# Altium schematic sheet Power Factor Correction.SchDoc (part 2 of 2)
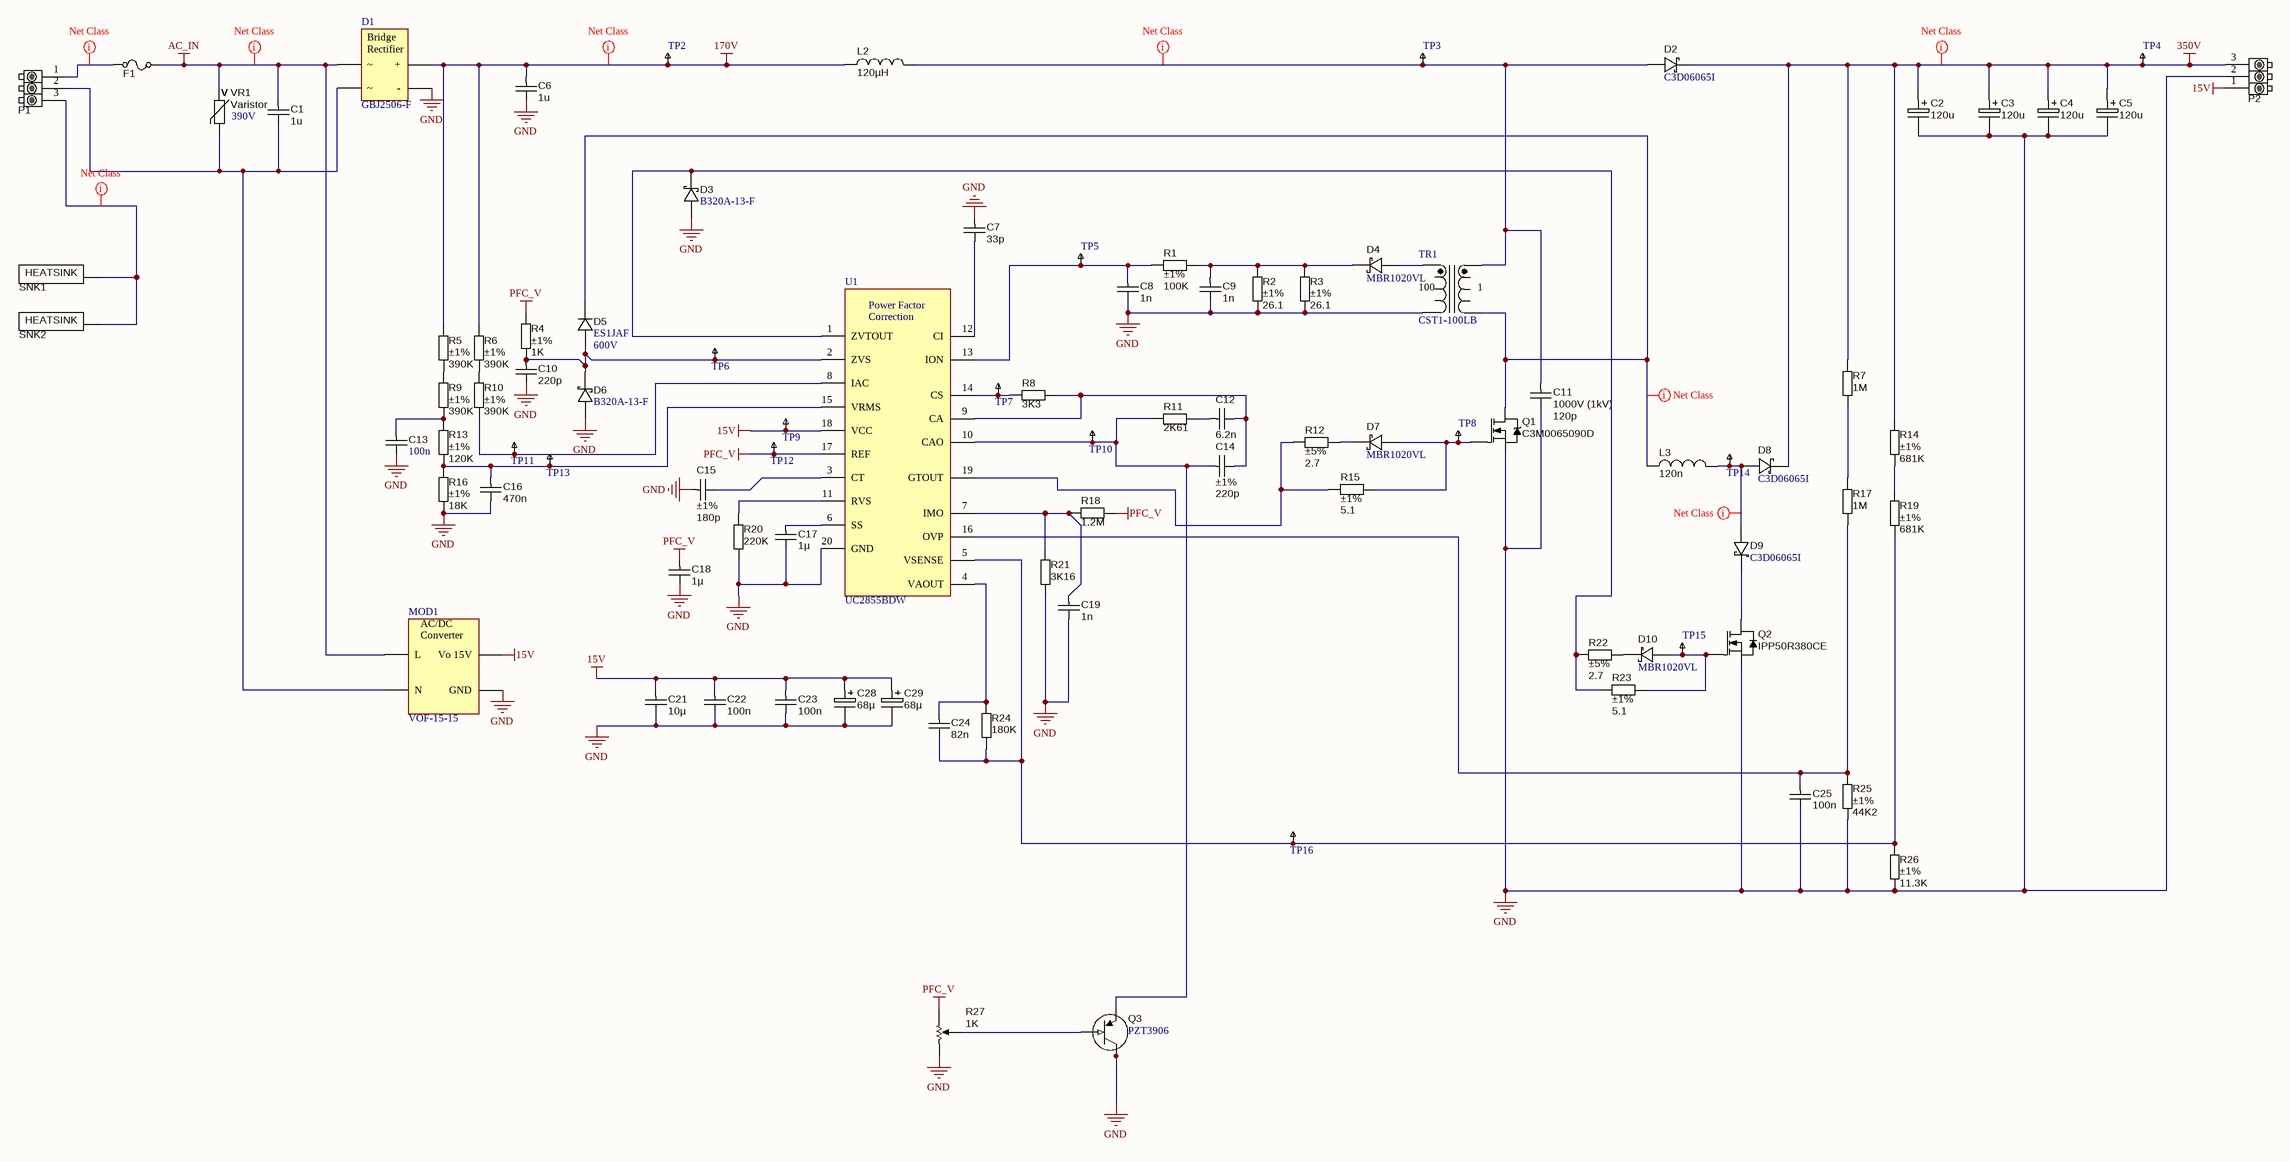
[diagram p1: Power Factor Correction.SchDoc]

## Notes on the sheet
- (in symbol AC_DC_265V_15V_VOF-15-15) AC/DC; Converter
- (in symbol BRIDGE_RECT_600V_25A_GBJ2506-F) Bridge; Rectifier
- (in symbol CURRENT_100:1_20A_CST1-100LB) 100; 1
- (in symbol HEATSINK_C247-025-1AE) HEATSINK
- (in symbol HEATSINK_OMNI-UNI-41-75) HEATSINK
- (in symbol PFC_UC2855BDW) Power Factor; Correction
- (in symbol Varistor_390V_4.5KA_B72214S0251K101) V

## Library data of the parts
C1 C6 = CAPMF_1u_420V_MK: 1µF Film Capacitor 220V 420V Polypropylene (PP), Metallized Radial; Manufacturer: KEMET; Tolerance: ±10%; Supplier 1: Digi-Key; Supplier Part Number 1: 399-13454-ND; RoHS: RoHS Compliant; Category: Capacitors; Stock 1: 1245; Pricing 1: 1=1.04, 10=0.793, 100=0.5673, 500=0.4392, 1000=0.3782, 2500=0.3538, 5000=0.3355 (USD); Packaging: Bulk; Part Status: Active; Voltage Rating - AC: 220V; Voltage Rating - DC: 420V; Dielectric Material: Polypropylene (PP), Metallized; Operating Temperature: -40°C ~ 110°C; Mounting Type: Through Hole; Package / Case: Radial; Size / Dimension: 0.709" L x 0.394" W (18.00mm x 10.00mm); Height - Seated (Max): 0.630" (16.00mm); Termination: PC Pins; Lead Spacing: 0.591" (15.00mm); Applications: High Frequency, Switching; High Pulse, DV/DT; Power Factor Correction (PFC); Features: -; ComponentLink1URL: https://search.kemet.com/component-edge/download/datasheet/R71MI4100AA30K.pdf; ComponentLink1Description: https://search.kemet.com/component-edge/download/datasheet/R71MI4100AA30K.pdf; Manufacturer Part Number: R71MI4100AA30K
C2-C5 = CAPE_120u_450V_THD: Aluminum Electrolytic Capacitors Radial, Can - Snap-In 2000 Hrs @ 85°C; Manufacturer: United Chemi-Con; Manufacturer Part Number: ESMR451VSN121MP25S; Tolerance: ±20%; Polarization: Polar; Ripple Current - Low Frequency: 1.12A @ 120Hz; Ripple Current - High Frequency: 1.6016A @ 50kHz; Supplier 1: Digi-Key; Supplier Part Number 1: 565-4506-ND; RoHS: RoHS Compliant; Category: Capacitors; Stock 1: 399; Pricing 1: 1=3.84, 10=3.098, 100=2.4161, 500=1.79656, 1000=1.67265, 2500=1.6107, 5000=1.6048 (USD); Packaging: Bulk; Part Status: Active; ESR (Equivalent Series Resistance): -; Lifetime @ Temp.: 2000 Hrs @ 85°C; Operating Temperature: -25°C ~ 85°C; Applications: General Purpose; Lead Spacing: 0.394" (10.00mm); Size / Dimension: 0.866" Dia (22.00mm); Height - Seated (Max): 1.083" (27.50mm); Surface Mount Land Size: -; Mounting Type: Through Hole; Package / Case: Radial, Can - Snap-In; ComponentLink1URL: http://www.chemi-con.co.jp/cgi-bin/CAT_DB/SEARCH/cat_db_al.cgi?e=e&j=p&pdfname=smrlug; ComponentLink1Description: http://www.chemi-con.co.jp/cgi-bin/CAT_DB/SEARCH/cat_db_al.cgi?e=e&j=p&pdfname=smrlug; Value: 120u
C7 = CAPC_33p_0603_NP0_50V_5%: Capacitor SMD Cer 33pF 5% 50V NP0 0603; Manufacturer: Murata Electronics North America; Manufacturer Part Number: GRM1885C1H330JA01D; Temperature Coefficient: C0G, NP0; Tolerance: ±5%; Supplier 1: Digi-Key; Supplier Part Number 1: 490-1415-1-ND; RoHS: RoHS Compliant; Category: Capacitors; Stock 1: 609419; Pricing 1: 1=0.1, 10=0.071, 100=0.0316, 500=0.0226, 1000=0.01776 (USD); Packaging: Cut Tape (CT); Part Status: Active; Voltage - Rated: 50V; Operating Temperature: -55°C ~ 125°C; Features: -; Ratings: -; Applications: General Purpose; Mounting Type: Surface Mount, MLCC; Package / Case: 0603 (1608 Metric); Size / Dimension: 0.063" L x 0.031" W (1.60mm x 0.80mm); Height - Seated (Max): -; Thickness (Max): 0.035" (0.90mm); Lead Spacing: -; Lead Style: -; ComponentLink1URL: http://www.murata.com/~/media/webrenewal/support/library/catalog/products/capacitor/mlcc/c02e.pdf; ComponentLink1Description: http://www.murata.com/~/media/webrenewal/support/library/catalog/products/capacitor/mlcc/c02e.pdf; Value: 33p
C8 C9 C19 = CAPC_1n_0603_X7R_100V_10%: Capacitor SMD Cer 1nF 10% 100V X7R 0603; Manufacturer 1: Murata Electronics North America; Manufacturer Part Number 1: GCM188R72A102KA37D; Ratings: 100V; X7R; Material: ceramic; SCDType: spec; Package / Case: 0603 (1608 metric); Tolerance: ±10%; Supplier 1: Digi-Key; Supplier Part Number 1: 490-4780-1-ND; Operating Temperature: -55°C ~ 125°C; Size / Dimension: 0.063" L x 0.031" W (1.60mm x 0.80mm); Thickness (Max): 0.035" (0.90mm); ComponentLink1URL: http://search.murata.co.jp/Ceramy/image/img/PDF/ENG/GCM188R72A102KA37.pdf; ComponentLink1Description: http://search.murata.co.jp/Ceramy/image/img/PDF/ENG/GCM188R72A102KA37.pdf
C10 = CAPC_220p_0603_NP0_50V_5%: Capacitor SMD Cer 220pF 5% 50V NP0 0603; Manufacturer 1: Murata Electronics North America; Manufacturer Part Number 1: GRM1885C1H221JA01D; Ratings: 50V; NP0; Material: Ceramic NP0; SCDType: spec; Tolerance: ±5%; Package / Case: 0603 (1608 metric); Supplier 1: Digi-Key; Supplier Part Number 1: 490-1435-1-ND; Value: 220p
C11 = CAPC_120p_1206_U2J_1KV_5%: Capacitor SMD Cer 120pF 5% U2J 1KV 1206; Manufacturer: Murata Electronics North America; Manufacturer Part Number: GRM31A7U3A121JW31D; Tolerance: ±5%; Supplier 1: Digi-Key; Supplier Part Number 1: 490-8331-1-ND; RoHS: RoHS Compliant; Category: Capacitors; Stock 1: 3961; Pricing 1: 1=0.48, 10=0.336, 100=0.2015, 500=0.15114, 1000=0.12764 (USD); Packaging: Cut Tape (CT); Part Status: Active; Temperature Coefficient: U2J; Operating Temperature: -55°C ~ 125°C; Features: -; Ratings: -; Applications: General Purpose; Mounting Type: Surface Mount, MLCC; Package / Case: 1206 (3216 Metric); Size / Dimension: 0.126" L x 0.063" W (3.20mm x 1.60mm); Height - Seated (Max): -; Thickness (Max): 0.039" (1.00mm); Lead Spacing: -; Lead Style: -; ComponentLink1URL: http://search.murata.co.jp/Ceramy/image/img/A01X/G101/ENG/GRM31A7U3A121JW31-01.pdf; ComponentLink1Description: http://search.murata.co.jp/Ceramy/image/img/A01X/G101/ENG/GRM31A7U3A121JW31-01.pdf; Value: 120p
C12 = CAPC_6.2nF_0603_NP0_50V: Capacitor SMD Cer 8pF ±0.5pF 50V NP0 0603; Manufacturer: Murata Electronics North America; Manufacturer Part Number: GRM2195C1H622JA01D; Tolerance: ±5%; Temperature Coefficient: C0G, NP0; Supplier 1: Digi-Key; Supplier Part Number 1: 490-1637-1-ND; RoHS: RoHS Compliant; Category: Capacitors; Stock 1: 29114; Pricing 1: 1=0.35, 10=0.241, 100=0.1364, 500=0.09626, 1000=0.08422 (USD); Packaging: Cut Tape (CT); Part Status: Active; Voltage - Rated: 50V; Operating Temperature: -55°C ~ 125°C; Features: -; Ratings: -; Applications: General Purpose; Mounting Type: Surface Mount, MLCC; Package / Case: 0805 (2012 Metric); Size / Dimension: 0.079" L x 0.049" W (2.00mm x 1.25mm); Height - Seated (Max): -; Thickness (Max): 0.037" (0.95mm); Lead Spacing: -; Lead Style: -; ComponentLink1URL: http://www.murata.com/~/media/webrenewal/support/library/catalog/products/capacitor/mlcc/c02e.ashx?la=en-us; ComponentLink1Description: http://www.murata.com/~/media/webrenewal/support/library/catalog/products/capacitor/mlcc/c02e.ashx?la=en-us; Value: 6.2n
C13 = CAPC_100n_1812_X7R_630V_10%: 0.1µF ±10% 630V Ceramic Capacitor X7R 1812 (4532 Metric); Manufacturer: Murata Electronics North America; Supplier 1: Digi-Key; Supplier Part Number 1: 490-3518-1-ND; RoHS: RoHS Compliant; Category: Capacitors; Stock 1: 64655; Pricing 1: 1=0.72, 10=0.531, 100=0.364, 500=0.2882 (USD); Packaging: Cut Tape (CT); Part Status: Active; Tolerance: ±10%; Voltage - Rated: 630V; Temperature Coefficient: X7R; Operating Temperature: -55°C ~ 125°C; Features: -; Ratings: -; Applications: General Purpose; Mounting Type: Surface Mount, MLCC; Package / Case: 1812 (4532 Metric); Size / Dimension: 0.177" L x 0.126" W (4.50mm x 3.20mm); Height - Seated (Max): -; Thickness (Max): 0.087" (2.20mm); Lead Spacing: -; Lead Style: -; ComponentLink1URL: http://search.murata.co.jp/Ceramy/image/img/A01X/G101/ENG/GRM43DR72J104KW01-01.pdf; ComponentLink1Description: http://search.murata.co.jp/Ceramy/image/img/A01X/G101/ENG/GRM43DR72J104KW01-01.pdf; Manufacturer Part Number: GRM43DR72J104KW01L
C14 = CAPC_220p_0603_NP0_50V_1%: Capacitor SMD Cer 220pF 1% 50V NP0 0603; Manufacturer 1: AVX Corporation; Manufacturer Part Number 1: 06035A221FAT2A; Ratings: 50V; NP0; SCDType: spec; Operating Temperature: -55°C ~ 125°C; Package / Case: 0603 (1608 Metric); Size / Dimension: 0.063" L x 0.031" W (1.60mm x 0.80mm); Thickness (Max): 0.037" (0.95mm); Manufacturer 2: TDK Corporation; Manufacturer Part Number 2: C1608C0G1H221F080AA; Supplier 1: Digi-Key; Supplier Part Number 1: 478-3719-1-ND; ComponentLink1URL: http://www.avx.com/docs/Catalogs/ccog.pdf; ComponentLink1Description: http://www.avx.com/docs/Catalogs/ccog.pdf; Supplier 2: Digi-Key; Supplier Part Number 2: 445-5369-1-ND; ComponentLink2URL: http://www.tdk.com/pdf/tight_tol_B11.pdf; ComponentLink2Description: http://www.tdk.com/pdf/tight_tol_B11.pdf; Supplier 3: Digi-Key; Supplier Part Number 3: 399-7876-1-ND; Manufacturer 3: Kemet; Manufacturer Part Number 3: C0603C221F5GACTU; ComponentLink3URL: http://www.kemet.com/datasheets&C0603C221F5GACTU; ComponentLink3Description: http://www.kemet.com/datasheets&C0603C221F5GACTU; Value: 220p
C15 = CAPC_180p_0603_NP0_50V_1%: Capacitor SMD Cer 180pF 1% 50V NP0 0603; Manufacturer 1: AVX Corporation; Manufacturer Part Number 1: 06035A181FAT2A; Ratings: 50V; NP0; SCDType: source; Operating Temperature: -55°C ~ 125°C; Package / Case: 0603 (1608 Metric); Size / Dimension: 0.063" L x 0.031" W (1.60mm x 0.80mm); Supplier 1: Digi-Key; Supplier Part Number 1: 478-6029-1-ND; ComponentLink1URL: http://www.avx.com/docs/Catalogs/ccog.pdf; ComponentLink1Description: http://www.avx.com/docs/Catalogs/ccog.pdf; Supplier 2: Digi-Key; Supplier Part Number 2: 1276-2211-1-ND; Manufacturer 2: Samsung Electro-Mechanics America, Inc; Manufacturer Part Number 2: CL10C181FB8NNNC; RoHS 2: RoHS Compliant; ComponentLink2URL: http://www.samsungsem.com/servlet/FileDownload?type=spec&file=CL10C181FB8NNNC.pdf; ComponentLink2Description: http://www.samsungsem.com/servlet/FileDownload?type=spec&file=CL10C181FB8NNNC.pdf; Supplier 3: Digi-Key; Supplier Part Number 3: C0603C181F5GACTU-ND; Manufacturer 3: Kemet; Manufacturer Part Number 3: C0603C181F5GACTU; RoHS 3: RoHS Compliant; ComponentLink3URL: http://www.kemet.com/datasheets&C0603C181F5GACTU; ComponentLink3Description: http://www.kemet.com/datasheets&C0603C181F5GACTU; Value: 180p
C16 = CAPC_470n_0805_X7R_50V_10%: 0.47µF ±10% 50V Ceramic Capacitor X7R 0805 (2012 Metric); Manufacturer: Murata Electronics North America; Manufacturer Part Number: GRM21BR71H474KA88K; Supplier 1: Digi-Key; Supplier Part Number 1: 490-8319-1-ND; RoHS: RoHS Compliant; Category: Capacitors; Stock 1: 76560; Pricing 1: 1=0.35, 10=0.244, 100=0.1465, 500=0.10986, 1000=0.09278, 2500=0.08789, 5000=0.08301 (USD); Packaging: Cut Tape (CT); Part Status: Active; Tolerance: ±10%; Voltage - Rated: 50V; Temperature Coefficient: X7R; Operating Temperature: -55°C ~ 125°C; Features: -; Ratings: -; Applications: General Purpose; Mounting Type: Surface Mount, MLCC; Package / Case: 0805 (2012 Metric); Size / Dimension: 0.079" L x 0.049" W (2.00mm x 1.25mm); Height - Seated (Max): -; Thickness (Max): 0.053" (1.35mm); Lead Spacing: -; Lead Style: -; ComponentLink1URL: http://search.murata.co.jp/Ceramy/image/img/A01X/G101/ENG/GRM21BR71H474KA88-01.pdf; ComponentLink1Description: http://search.murata.co.jp/Ceramy/image/img/A01X/G101/ENG/GRM21BR71H474KA88-01.pdf
C17 C18 = CAPC_1u_1206_X7R_35V_10%: Capacitor SMD Cer 1uF 10% 35V X7R 1206; Ratings: 35V; X7R; Material: ceramic; SCDType: spec; Package / Case: 0805 (2012 metric); Tolerance: ±10%; Temperature Coefficient: X7R; ComponentLink1URL: http://www.yageo.com/documents/recent/UPY-GPHC_X7R_6.3V-to-50V_8.pdf; ComponentLink1Description: http://www.yageo.com/documents/recent/UPY-GPHC_X7R_6.3V-to-50V_8.pdf; ComponentLink2URL: http://www.kemet.com/datasheets&C0805C105K4RACTU; ComponentLink2Description: http://www.kemet.com/datasheets&C0805C105K4RACTU; ComponentLink3URL: http://www.samsungsem.com/servlet/FileDownload?type=spec&file=CL21B105KOFNNNE.pdf; ComponentLink3Description: http://www.samsungsem.com/servlet/FileDownload?type=spec&file=CL21B105KOFNNNE.pdf; ComponentLink4URL: http://product.tdk.com/capacitor/mlcc/en/documents/mlcc_commercial_general_en.pdf; ComponentLink4Description: http://product.tdk.com/capacitor/mlcc/en/documents/mlcc_commercial_general_en.pdf; Supplier 1: Digi-Key; Supplier Part Number 1: 587-1326-1-ND
C21 = CAPC_10u_1210_50V: Capacitor SMD Cer 10uF 20% 16V X5R 1210; Manufacturer 1: Taiyo Yuden; Manufacturer Part Number 1: UMK325BJ106MM-T; Ratings: 50V; X5R; Material: ceramic; SCDType: spec; Package / Case: 1210 (3225 Metric); Tolerance: ±20%; Size / Dimension: 0.126" L x 0.098" W (3.20mm x 2.50mm); Supplier 1: Digi-Key; Supplier Part Number 1: 587-2225-1-ND; Value: 10µ
C22 C23 = CAPC_100n_0805_X7R_50V_10%: Capacitor SMD Cer 100nF 10% 50V X7R 0805; Manufacturer 1: Kemet; Manufacturer Part Number 1: C0805C104K5RACTU; Ratings: 50V; X7R; Material: ceramic; SCDType: undef; Package / Case: 0805 (2012 metric); Tolerance: ±10%; Supplier 1: Digi-Key; Supplier Part Number 1: 399-1170-1-ND
C24 = CAPC_82n_0603_X7R_50V_10%: Capacitor SMD Cer 82nF 10% 50V X7R 0603; Manufacturer: Murata Electronics North America; Manufacturer Part Number: GRM188R71H823KA93D; Voltage - Rated: 50V; Supplier 1: Digi-Key; Supplier Part Number 1: 490-7771-1-ND; RoHS: RoHS Compliant; Category: Capacitors; Stock 1: 51224; Pricing 1: 1=0.18, 10=0.128, 100=0.06, 500=0.04208, 1000=0.03483 (USD); Packaging: Cut Tape (CT); Part Status: Active; Tolerance: ±10%; Temperature Coefficient: X7R; Operating Temperature: -55°C ~ 125°C; Features: -; Ratings: -; Applications: General Purpose; Mounting Type: Surface Mount, MLCC; Package / Case: 0603 (1608 Metric); Size / Dimension: 0.063" L x 0.031" W (1.60mm x 0.80mm); Height - Seated (Max): -; Thickness (Max): 0.035" (0.90mm); Lead Spacing: -; Lead Style: -; ComponentLink1URL: http://www.murata.com/~/media/webrenewal/support/library/catalog/products/capacitor/mlcc/c02e.pdf; ComponentLink1Description: http://www.murata.com/~/media/webrenewal/support/library/catalog/products/capacitor/mlcc/c02e.pdf
C25 = CAPC_100n_0603_X7R_50V_10%: Capacitor SMD Cer 100nF 10% 50V X7R 0603; Manufacturer: Murata Electronics North America; Manufacturer Part Number: GRM188R71H104KA93D; Tolerance: ±10%; Supplier 1: Digi-Key; Supplier Part Number 1: 490-1519-1-ND; RoHS: RoHS Compliant; Category: Capacitors; Stock 1: 21293840; Pricing 1: 1=0.12, 10=0.084, 100=0.0396, 500=0.02778, 1000=0.023 (USD); Packaging: Cut Tape (CT); Part Status: Active; Voltage - Rated: 50V; Temperature Coefficient: X7R; Operating Temperature: -55°C ~ 125°C; Features: -; Ratings: -; Applications: General Purpose; Mounting Type: Surface Mount, MLCC; Package / Case: 0603 (1608 Metric); Size / Dimension: 0.063" L x 0.031" W (1.60mm x 0.80mm); Height - Seated (Max): -; Thickness (Max): 0.035" (0.90mm); Lead Spacing: -; Lead Style: -; ComponentLink1URL: http://www.murata.com/~/media/webrenewal/support/library/catalog/products/capacitor/mlcc/c02e.pdf; ComponentLink1Description: http://www.murata.com/~/media/webrenewal/support/library/catalog/products/capacitor/mlcc/c02e.pdf
C28 C29 = CAPP_68u_35V_SMD: Capacitor SMD Alum Polymer 68uF 20% 35V; Ratings: 35V; 105°C; Tolerance: ±20%; Supplier 1: Digi-Key; Supplier Part Number 1: 565-4186-1-ND
D1 = BRIDGE_RECT_600V_25A_GBJ2506-F: Bridge Rectifier Single Phase 600V 25A Through Hole GBJ; Manufacturer: Diodes Incorporated; Voltage - Forward (Vf) (Max) @ If: 1.05V @ 12.5A; Current - Reverse Leakage @ Vr: 10µA @ 600V; Supplier 1: Digi-Key; Supplier Part Number 1: GBJ2506-FDI-ND; RoHS: RoHS Compliant; Category: Discrete Semiconductor Products; Stock 1: 4710; Pricing 1: 1=1.45, 15=1.298, 105=1.012, 510=0.836, 1005=0.66 (USD); Packaging: Tube; Part Status: Active; Diode Type: Single Phase; Technology: Standard; Voltage - Peak Reverse (Max): 600V; Current - Average Rectified (Io): 25A; Operating Temperature: -65°C ~ 150°C (TJ); Mounting Type: Through Hole; Package / Case: 4-SIP, GBJ; Supplier Device Package: GBJ; ComponentLink1URL: https://www.diodes.com/assets/Datasheets/ds21221.pdf; ComponentLink1Description: https://www.diodes.com/assets/Datasheets/ds21221.pdf; Manufacturer Part Number: GBJ2506-F
D2 D8 D9 = DIODE_SIC_SCHOTTKY_650V_13A_C3D06065I: Diode Silicon Carbide Schottky 13A (DC) Through Hole TO-220-2 Isolated Tab; Manufacturer: Cree/Wolfspeed; Voltage - Forward (Vf) (Max) @ If: 1.7V @ 6A; Speed: No Recovery Time > 500mA (Io); Current - Reverse Leakage @ Vr: 50µA @ 650V; Capacitance @ Vr, F: 295pF @ 0V, 1MHz; Supplier 1: Digi-Key; Supplier Part Number 1: C3D06065I-ND; RoHS: RoHS Compliant; Category: Discrete Semiconductor Products; Stock 1: 996; Pricing 1: 1=3.22, 100=2.68, 500=2.30002, 1000=2.0125 (USD); Packaging: Tube; Part Status: Active; Diode Type: Silicon Carbide Schottky; Current - Average Rectified (Io): 13A (DC); Mounting Type: Through Hole; Package / Case: TO-220-2 Isolated Tab; Supplier Device Package: TO-220-2 Isolated Tab; Operating Temperature - Junction: -55°C ~ 175°C; ComponentLink1URL: http://www.wolfspeed.com/media/downloads/44/C3D06065I.pdf; ComponentLink1Description: http://www.wolfspeed.com/media/downloads/44/C3D06065I.pdf; Manufacturer Part Number: C3D06065I
D3 D6 = DIODE_SCHOTTKY_20V_3A_B320A-13-F: Diode Schottky 20V 3A Surface Mount SMA; Manufacturer: Diodes Incorporated; Voltage - Forward (Vf) (Max) @ If: 500mV @ 3A; Speed: Fast Recovery =< 500ns, > 200mA (Io); Current - Reverse Leakage @ Vr: 500µA @ 20V; Capacitance @ Vr, F: 200pF @ 4V, 1MHz; Supplier 1: Digi-Key; Supplier Part Number 1: B320A-FDICT-ND; RoHS: RoHS Compliant; Category: Discrete Semiconductor Products; Stock 1: 99912; Pricing 1: 1=0.57, 10=0.463, 100=0.3154, 500=0.23658, 1000=0.17743 (USD); Packaging: Cut Tape (CT); Part Status: Active; Diode Type: Schottky; Current - Average Rectified (Io): 3A; Mounting Type: Surface Mount; Package / Case: DO-214AC, SMA; Supplier Device Package: SMA; Operating Temperature - Junction: -55°C ~ 150°C; ComponentLink1URL: https://www.diodes.com/assets/Datasheets/ds30891.pdf; ComponentLink1Description: https://www.diodes.com/assets/Datasheets/ds30891.pdf; Manufacturer Part Number: B320A-13-F
D4 D7 D10 = DIODE_SCHOTTKY_20V_1A_MBR1020VL: Diode Schottky 20V 1A Surface Mount SOD-123F; Manufacturer: Fairchild/ON Semiconductor; Voltage - Forward (Vf) (Max) @ If: 340mV @ 1A; Speed: Fast Recovery =< 500ns, > 200mA (Io); Current - Reverse Leakage @ Vr: 600µA @ 20V; Supplier 1: Digi-Key; Supplier Part Number 1: MBR1020VLCT-ND; RoHS: RoHS Compliant; Category: Discrete Semiconductor Products; Stock 1: 10857; Pricing 1: 1=0.39, 10=0.293, 100=0.1661, 500=0.11, 1000=0.08433 (USD); Packaging: Cut Tape (CT); Part Status: Active; Diode Type: Schottky; Current - Average Rectified (Io): 1A; Capacitance @ Vr, F: -; Mounting Type: Surface Mount; Package / Case: SOD-123F; Supplier Device Package: SOD-123F; Operating Temperature - Junction: -55°C ~ 125°C; ComponentLink1URL: https://www.fairchildsemi.com/datasheets/MB/MBR1020VL.pdf; ComponentLink1Description: https://www.fairchildsemi.com/datasheets/MB/MBR1020VL.pdf
D5 = DIODE_600V_1A_SMA_ES1JAF: Diode Standard 1A Surface Mount DO-214AD (SMAF); Manufacturer: Fairchild/ON Semiconductor; Voltage - Forward (Vf) (Max) @ If: 1.7V @ 1A; Speed: Fast Recovery =< 500ns, > 200mA (Io); Current - Reverse Leakage @ Vr: 1µA @ 600V; Capacitance @ Vr, F: 15pF @ 4V, 1MHz; Supplier 1: Digi-Key; Supplier Part Number 1: ES1JAFCT-ND; Packaging: Cut Tape (CT); Part Status: Active; Diode Type: Standard; Current - Average Rectified (Io): 1A; Mounting Type: Surface Mount; Package / Case: DO-214AD, SMAF; Supplier Device Package: DO-214AD (SMAF); Operating Temperature - Junction: -55°C ~ 150°C; ComponentLink1URL: https://www.fairchildsemi.com/datasheets/ES/ES1DAF.pdf; ComponentLink1Description: https://www.fairchildsemi.com/datasheets/ES/ES1DAF.pdf; RoHS: RoHS Compliant; Category: Discrete Semiconductor Products; Stock 1: 3712; Pricing 1: 1=0.42, 10=0.344, 100=0.2343, 500=0.17572, 1000=0.13179 (USD); Manufacturer Part Number: ES1JAF
F1 = FUSE_HOLDER_   03540101ZXGY: Fuse Block 600V Circuit Cartridge PCB; Manufacturer: Littelfuse Inc.; For Use With/Related Products: 3AB, 3AG; Fuse Size: 1/4" Dia x 1 1/4" L (6.4mm x 31.8mm); Supplier 1: Digi-Key; Supplier Part Number 1: F1498-ND; RoHS: RoHS Compliant; Category: Circuit Protection; Stock 1: 5410; Pricing 1: 1=1.25, 5=1.21, 10=1.131, 50=0.936, 100=0.78, 250=0.76052, 500=0.6435, 1000=0.5655, 5000=0.507 (USD); Part Status: Active; Fuseholder Type: Block; Fuse Type: Cartridge; Voltage: 600V; Mounting Type: PCB; Orientation: Horizontal; Termination Style: PC Pin; Contact Material: Phosphorus Bronze; Contact Finish: Tin; ComponentLink1URL: http://www.littelfuse.com/~/media/electronics/datasheets/fuse_blocks/littelfuse_fuse_block_354_datasheet.pdf.pdf; ComponentLink1Description: http://www.littelfuse.com/~/media/electronics/datasheets/fuse_blocks/littelfuse_fuse_block_354_datasheet.pdf.pdf; Manufacturer Part Number: 03540101ZXGY
L2 = INDC_120u_ETD44_8A: Custom Wound ETD44; Bobbin Manufacturer Part Number: B66366B1018T001; Manufacturer: EPCOS (TDK); Tolerance: ±10%; Wire Gauge: 12 AWG; Accessory Type: Bobbin (Coil Former), Horizontal; For Use With/Related Products: ETD; Value: 120µH; Supplier 1: Digi-Key; Supplier Part Number 1: 495-5481-ND; RoHS: RoHS Compliant; Category: Magnetics - Transformer, Inductor Components; Stock 1: 901; Pricing 1: 1=2.23, 10=1.915, 25=1.4364, 50=1.3966, 100=1.2369, 250=1.15712, 500=1.0773, 1000=0.9975 (USD); Part Status: Active; Supplier Device Package: ETD 44 x 22 x 15; ComponentLink1URL: https://product.tdk.com/info/en/documents/data_sheet/etd_44_22_15.pdf; ComponentLink1Description: https://product.tdk.com/info/en/documents/data_sheet/etd_44_22_15.pdf; Manufacturer Part Number: B66366B1018T001
L3 = INDC_120n_48.8A: Power Inductor 120nH 48.8A; Tolerance: 10±; DCR: 0.47; Manufacturer Part Number: SLR1050B-121KE_
MOD1 = AC_DC_265V_15V_VOF-15-15: Open Frame AC DC Converter 1 Output 15V 1A 85 ~ 264 VAC Input; Manufacturer: CUI Inc.; Number of Outputs: 1; Power (Watts): 15W; Efficiency: 80%; Line Regulation: ±0.5%; Load Regulation: ±1%; Approvals: CE, cULus, TUV; Supplier 1: Digi-Key; Supplier Part Number 1: 102-2047-ND; RoHS: RoHS Compliant; Category: Power Supplies - Board Mount; Stock 1: 400; Pricing 1: 1=16.8, 5=16.56, 10=16.32, 25=15.36, 50=14.88, 100=14.4, 250=13.92, 500=13.44 (USD); Part Status: Active; Type: Open Frame; Voltage - Input: 85 ~ 264 VAC; Voltage - Output 1: 15V; Voltage - Output 2: -; Voltage - Output 3: -; Voltage - Output 4: -; Current - Output (Max): 1A; Applications: ITE (Commercial); Features: OCP, OVP, SCP; Operating Temperature: 0°C ~ 60°C (With Derating); Mounting Type: Through Hole; Package / Case: 4-DIP Module; Size / Dimension: 2.76" L x 1.91" W x 0.91" H (70.0mm x 48.6mm x 23.1mm); Weight: -; ComponentLink1URL: http://www.cui.com/product/resource/digikeypdf/vof-15.pdf; ComponentLink1Description: http://www.cui.com/product/resource/digikeypdf/vof-15.pdf; Manufacturer Part Number: VOF-15-15
P1 P2 = 3P_TERM BLOCK 796739-3: 3 Position Wire to Board Terminal Block Horizontal with Board 0.375" (9.53mm) Through Hole; Manufacturer: TE Connectivity AMP Connectors; Number of Levels: 1; Positions Per Level: 3; Current: 30A; Voltage: 600V; Wire Gauge: 10-30 AWG; Wire Termination: Screw - Rising Cage Clamp; Clamp Material - Plating: Brass - Nickel Plated; Torque - Screw: 0.79 Nm (7.0 Lb-In); Screw Thread: M3; Supplier 1: Digi-Key; Supplier Part Number 1: A98274-ND; RoHS: RoHS Compliant; Category: Connectors, Interconnects; Stock 1: 1080; Pricing 1: 1=5.17, 10=3.942, 25=3.692, 50=3.2816, 100=3.2104, 250=2.96064, 500=2.6753, 1000=2.37209, 2500=2.274 (USD); Packaging: Tray; Part Status: Active; Pitch: 0.375" (9.53mm); Mating Orientation: Horizontal with Board; Mounting Type: Through Hole; Features: Interlocking (Side); Color: Green; Operating Temperature: -; Housing Material: Polyamide (PA66), Nylon 6/6; Contact Material - Plating: -; Screw Material - Plating: Brass - Nickel Plated; ComponentLink1URL: http://www.te.com/commerce/DocumentDelivery/DDEController?Action=srchrtrv&DocNm=796739&DocType=Customer+Drawing&DocLang=English; ComponentLink1Description: http://www.te.com/commerce/DocumentDelivery/DDEController?Action=srchrtrv&DocNm=796739&DocType=Customer+Drawing&DocLang=English; Manufacturer Part Number: 796739-3
Q1 = SiC_N-CHAN_900V_36A_C3M0065090D: N-Channel 36A (Tc) 125W (Tc) Through Hole TO-247-3; Manufacturer: Cree/Wolfspeed; Drive Voltage (Max Rds On,  Min Rds On): 15V; Vgs(th) (Max) @ Id: 2.1V @ 5mA; Gate Charge (Qg) (Max) @ Vgs: 30.4nC @ 15V; Input Capacitance (Ciss) (Max) @ Vds: 660pF @ 600V; Vgs (Max): +18V, -8V; Rds On (Max) @ Id, Vgs: 78 mOhm @ 20A, 15V; Supplier 1: Digi-Key; Supplier Part Number 1: C3M0065090D-ND; RoHS: RoHS Compliant; Category: Discrete Semiconductor Products; Stock 1: 2984; Pricing 1: 1=10.5 (USD); Packaging: Tube; Part Status: Active; FET Type: N-Channel; Technology: SiCFET (Silicon Carbide); Current - Continuous Drain (Id) @ 25°C: 36A (Tc); FET Feature: -; Power Dissipation (Max): 125W (Tc); Operating Temperature: -55°C ~ 150°C (TJ); Mounting Type: Through Hole; Supplier Device Package: TO-247-3; Package / Case: TO-247-3; ComponentLink1URL: http://www.wolfspeed.com/media/downloads/176/C3M0065090D.pdf; ComponentLink1Description: http://www.wolfspeed.com/media/downloads/176/C3M0065090D.pdf; Manufacturer Part Number: C3M0065090D
Q2 = MOSFET_N-CHAN_IPP50R380CE: N-Channel 9.9A (Tc) 73W (Tc) Through Hole PG-TO-220-3; Manufacturer: Infineon Technologies; Drive Voltage (Max Rds On,  Min Rds On): 13V; Vgs(th) (Max) @ Id: 3.5V @ 260µA; Gate Charge (Qg) (Max) @ Vgs: 24.8nC @ 10V; Input Capacitance (Ciss) (Max) @ Vds: 584pF @ 100V; Vgs (Max): ±20V; FET Feature: Super Junction; Rds On (Max) @ Id, Vgs: 380 mOhm @ 3.2A, 13V; Supplier 1: Digi-Key; Supplier Part Number 1: IPP50R380CE-ND; RoHS: RoHS Compliant; Category: Discrete Semiconductor Products; Stock 1: 183; Pricing 1: 1=1.16, 10=1.039, 100=0.8104, 500=0.66942, 1000=0.5285 (USD); Packaging: Tube; Part Status: Active; FET Type: N-Channel; Technology: MOSFET (Metal Oxide); Current - Continuous Drain (Id) @ 25°C: 9.9A (Tc); Power Dissipation (Max): 73W (Tc); Operating Temperature: -55°C ~ 150°C (TJ); Mounting Type: Through Hole; Supplier Device Package: PG-TO-220-3; Package / Case: TO-220-3; ComponentLink1URL: http://www.infineon.com/dgdl/IPx50R380CE_2.0.pdf?folderId=db3a3043163797a6011637d4bae7003b&fileId=db3a30432e398416012e5273936c15b0; ComponentLink1Description: http://www.infineon.com/dgdl/IPx50R380CE_2.0.pdf?folderId=db3a3043163797a6011637d4bae7003b&fileId=db3a30432e398416012e5273936c15b0; Manufacturer Part Number: IPP50R380CE
Q3 = PNP_PZT3906: Bipolar (BJT) Transistor PNP 40V 200mA 250MHz 1W Surface Mount SOT-223-4; Manufacturer: ON Semiconductor; Vce Saturation (Max) @ Ib, Ic: 400mV @ 5mA, 50mA; DC Current Gain (hFE) (Min) @ Ic, Vce: 100 @ 10mA, 1V; Supplier 1: Digi-Key; Supplier Part Number 1: PZT3906CT-ND; RoHS: RoHS Compliant; Category: Discrete Semiconductor Products; Stock 1: 13235; Pricing 1: 1=0.49, 10=0.369, 100=0.2297, 500=0.1572, 1000=0.12092 (USD); Packaging: Cut Tape (CT); Part Status: Active; Transistor Type: PNP; Current - Collector Cutoff (Max): -; Frequency - Transition: 250MHz; Operating Temperature: -55°C ~ 150°C (TJ); Mounting Type: Surface Mount; Package / Case: TO-261-4, TO-261AA; Supplier Device Package: SOT-223-4; ComponentLink1URL: https://www.fairchildsemi.com/datasheets/2N/2N3906.pdf; ComponentLink1Description: https://www.fairchildsemi.com/datasheets/2N/2N3906.pdf
R1 = RES_100K_0603_1%: Resistor SMD chip 100k Ohm 0.1W 1% 0603; Manufacturer 1: Vishay/Dale; Manufacturer Part Number 1: CRCW0603100KFKEA; Ratings: 1/10W; SCDType: spec; Package / Case: 0603 (2012 metric); Supplier 1: Digi-Key; Supplier Part Number 1: 541-100KHCT-ND
R2 R3 = RES_26R1_0805_1%: Resistor SMD chip 26.1k Ohm 0.125W 1% 0805; Manufacturer: Panasonic Electronic Components; Manufacturer Part Number: ERJ-6ENF26R1V; Power (Watts): 0.125W, 1/8W; Temperature Coefficient: ±100ppm/°C; Supplier 1: Digi-Key; Supplier Part Number 1: P26.1CCT-ND; RoHS: RoHS Compliant; Category: Resistors; Stock 1: 23109; Pricing 1: 1=0.1, 10=0.041, 100=0.0167, 1000=0.00749, 2500=0.0065 (USD); Packaging: Cut Tape (CT); Part Status: Active; Composition: Thick Film; Features: Automotive AEC-Q200; Operating Temperature: -55°C ~ 155°C; Package / Case: 0805 (2012 Metric); Supplier Device Package: 0805; Size / Dimension: 0.079" L x 0.049" W (2.00mm x 1.25mm); Height - Seated (Max): 0.028" (0.70mm); Failure Rate: -; ComponentLink1URL: https://industrial.panasonic.com/cdbs/www-data/pdf/RDA0000/AOA0000C304.pdf; ComponentLink1Description: https://industrial.panasonic.com/cdbs/www-data/pdf/RDA0000/AOA0000C304.pdf
R4 = RES_1K_0603_1%: Resistor SMD chip 1k Ohm 0.1W 1% 0603; Manufacturer 1: Yageo; Manufacturer Part Number 1: RC0603FR-071KL; Ratings: 1/10W; SCDType: spec; Package / Case: 0603 (1608 Metric); Supplier 1: Digi-Key; Supplier Part Number 1: 311-1.00KHRCT-ND
R5 R6 R9 R10 = RES_390K_0805_1%: Resistor SMD chip 390k Ohm 0.125W 1% 0805; Manufacturer: Panasonic Electronic Components; Manufacturer Part Number: ERJ-6GEYJ394V; Power (Watts): 0.125W, 1/8W; Temperature Coefficient: ±200ppm/°C; Supplier 1: Digi-Key; Supplier Part Number 1: P390KACT-ND; RoHS: RoHS Compliant; Category: Resistors; Stock 1: 94774; Pricing 1: 1=0.1, 10=0.028, 100=0.0113, 1000=0.00509, 2500=0.00442 (USD); Packaging: Cut Tape (CT); Part Status: Active; Composition: Thick Film; Features: Automotive AEC-Q200; Operating Temperature: -55°C ~ 155°C; Package / Case: 0805 (2012 Metric); Supplier Device Package: 0805; Size / Dimension: 0.079" L x 0.049" W (2.00mm x 1.25mm); Height - Seated (Max): 0.028" (0.70mm); Failure Rate: -; ComponentLink1URL: http://industrial.panasonic.com/www-cgi/jvcr13pz.cgi?E+PZ+3+AOA0001+ERJ6GEYJ394V+7+WW; ComponentLink1Description: http://industrial.panasonic.com/www-cgi/jvcr13pz.cgi?E+PZ+3+AOA0001+ERJ6GEYJ394V+7+WW
R7 R17 = RES_1M_0805_1%: Resistor SMD chip 1M Ohm 0.125W 1% 0805; Manufacturer: Panasonic Electronic Components; Manufacturer Part Number: ERJ-3EKF1004V; Power (Watts): 0.1W, 1/10W; Temperature Coefficient: ±100ppm/°C; Tolerance: ±1%; Supplier 1: Digi-Key; Supplier Part Number 1: P1.00MHCT-ND; RoHS: RoHS Compliant; Category: Resistors; Stock 1: 2001; Pricing 1: 1=0.1, 10=0.021, 100=0.0087, 1000=0.00389, 2500=0.00338 (USD); Packaging: Cut Tape (CT); Part Status: Active; Composition: Thick Film; Features: Automotive AEC-Q200; Operating Temperature: -55°C ~ 155°C; Package / Case: 0603 (1608 Metric); Supplier Device Package: 0603; Size / Dimension: 0.063" L x 0.031" W (1.60mm x 0.80mm); Height - Seated (Max): 0.022" (0.55mm); Failure Rate: -; ComponentLink1URL: https://industrial.panasonic.com/cdbs/www-data/pdf/RDA0000/AOA0000C304.pdf; ComponentLink1Description: https://industrial.panasonic.com/cdbs/www-data/pdf/RDA0000/AOA0000C304.pdf
R8 = RES_3K3_0603_1%: Resistor SMD chip 3.3k Ohm 0.1W 1% 0603; Manufacturer 1: Yageo; Manufacturer Part Number 1: RC0603JR-073K3L; Manufacturer Part Number: RC0603FR-073K3L; Ratings: 1/10 W; SCDType: undef; Power (Watts): 0.1W, 1/10W; Temperature Coefficient: ±100ppm/°C; Package / Case: 0603 (1608 metric); Tolerance: ±1%; Material: thick film; Supplier 1: Digi-Key; Supplier Part Number 1: 311-3.3KGRTR-ND; Supplier 2: Digi-Key; Supplier Part Number 2: 311-3.30KHRCT-ND; Manufacturer: Yageo; RoHS: RoHS Compliant; Category: Resistors; Stock 2: 2808281; Pricing 2: 1=0.1, 10=0.015, 100=0.006, 1000=0.00268, 2500=0.00233 (USD); Packaging: Cut Tape (CT); Part Status: Active; Composition: Thick Film; Features: Moisture Resistant; Operating Temperature: -55°C ~ 155°C; Supplier Device Package: 0603; Size / Dimension: 0.063" L x 0.031" W (1.60mm x 0.80mm); Height - Seated (Max): 0.022" (0.55mm); Failure Rate: -; ComponentLink1URL: http://www.yageo.com/documents/recent/PYu-RC_Group_51_RoHS_L_7.pdf; ComponentLink1Description: http://www.yageo.com/documents/recent/PYu-RC_Group_51_RoHS_L_7.pdf
R11 = RES_2K61_0603_1%: Resistor SMD chip 2.61k Ohm 0.1W 1% 0603; Manufacturer: Panasonic Electronic Components; Manufacturer Part Number: ERJ-3EKF2611V; Power (Watts): 0.1W, 1/10W; Temperature Coefficient: ±100ppm/°C; Supplier 1: Digi-Key; Supplier Part Number 1: P2.61KHCT-ND; RoHS: RoHS Compliant; Category: Resistors; Stock 1: 177648; Pricing 1: 1=0.1, 10=0.057, 100=0.0233, 1000=0.01048, 2500=0.0091 (USD); Packaging: Cut Tape (CT); Part Status: Active; Tolerance: ±1%; Composition: Thick Film; Features: Automotive AEC-Q200; Operating Temperature: -55°C ~ 155°C; Package / Case: 0603 (1608 Metric); Supplier Device Package: 0603; Size / Dimension: 0.063" L x 0.032" W (1.60mm x 0.80mm); Height - Seated (Max): 0.022" (0.55mm); Failure Rate: -; ComponentLink1URL: https://industrial.panasonic.com/cdbs/www-data/pdf/RDA0000/AOA0000C304.pdf; ComponentLink1Description: https://industrial.panasonic.com/cdbs/www-data/pdf/RDA0000/AOA0000C304.pdf
R12 R22 = RES_2R7_0603_5%: Resistor SMD chip 2.7 Ohm 0.1W 5% 0603; Manufacturer: Panasonic Electronic Components; Manufacturer Part Number: ERJ-3GEYJ2R7V; Power (Watts): 0.1W, 1/10W; Temperature Coefficient: -100/ +600ppm/°C; Supplier 1: Digi-Key; Supplier Part Number 1: P2.7GCT-ND; RoHS: RoHS Compliant; Category: Resistors; Stock 1: 117973; Pricing 1: 1=0.1, 10=0.018, 100=0.0073, 1000=0.00329, 2500=0.00286 (USD); Packaging: Cut Tape (CT); Part Status: Active; Composition: Thick Film; Features: Automotive AEC-Q200; Operating Temperature: -55°C ~ 155°C; Package / Case: 0603 (1608 Metric); Supplier Device Package: 0603; Size / Dimension: 0.063" L x 0.031" W (1.60mm x 0.80mm); Height - Seated (Max): 0.022" (0.55mm); Failure Rate: -; ComponentLink1URL: http://industrial.panasonic.com/www-cgi/jvcr13pz.cgi?E+PZ+3+AOA0001+ERJ3GEYJ2R7V+7+WW; ComponentLink1Description: http://industrial.panasonic.com/www-cgi/jvcr13pz.cgi?E+PZ+3+AOA0001+ERJ3GEYJ2R7V+7+WW
R13 = RES_120K_0603_1%: Resistor SMD chip 120K Ohm 0.1W 1% 0603; Manufacturer: Panasonic Electronic Components; Manufacturer Part Number: ERJ-PA3F1203V; Power (Watts): 0.25W, 1/4W; Temperature Coefficient: ±100ppm/°C; Supplier 1: Digi-Key; Supplier Part Number 1: P120KBYCT-ND; RoHS: RoHS Compliant; Category: Resistors; Stock 1: 2172; Pricing 1: 1=0.16, 10=0.144, 100=0.0554, 1000=0.02436, 2500=0.02104 (USD); Packaging: Cut Tape (CT); Part Status: Active; Composition: Thick Film; Features: Automotive AEC-Q200, Pulse Withstanding; Operating Temperature: -55°C ~ 155°C; Package / Case: 0603 (1608 Metric); Supplier Device Package: 0603; Size / Dimension: 0.063" L x 0.031" W (1.60mm x 0.80mm); Height - Seated (Max): 0.022" (0.55mm); Failure Rate: -; ComponentLink1URL: https://industrial.panasonic.com/cdbs/www-data/pdf/RDO0000/AOA0000C331.pdf; ComponentLink1Description: https://industrial.panasonic.com/cdbs/www-data/pdf/RDO0000/AOA0000C331.pdf
R14 R19 = RES_681K_0805_1%: Resistor SMD chip 681K Ohm 0.125W 1% 0805; Manufacturer: Panasonic Electronic Components; Manufacturer Part Number: ERJ-6ENF6813V; Power (Watts): 0.125W, 1/8W; Temperature Coefficient: ±100ppm/°C; Supplier 1: Digi-Key; Supplier Part Number 1: P681KCCT-ND; RoHS: RoHS Compliant; Category: Resistors; Stock 1: 119799; Pricing 1: 1=0.1, 10=0.041, 100=0.0167, 1000=0.00749, 2500=0.0065 (USD); Packaging: Cut Tape (CT); Part Status: Active; Composition: Thick Film; Features: Automotive AEC-Q200; Operating Temperature: -55°C ~ 155°C; Package / Case: 0805 (2012 Metric); Supplier Device Package: 0805; Size / Dimension: 0.079" L x 0.049" W (2.00mm x 1.25mm); Height - Seated (Max): 0.028" (0.70mm); Failure Rate: -; ComponentLink1URL: https://industrial.panasonic.com/cdbs/www-data/pdf/RDA0000/AOA0000C304.pdf; ComponentLink1Description: https://industrial.panasonic.com/cdbs/www-data/pdf/RDA0000/AOA0000C304.pdf
R15 R23 = RES_5R1_0603_1%: Resistor SMD chip 5.1 Ohm 0.1W 1% 0603; Manufacturer: Yageo; Manufacturer Part Number: RC0603FR-075R1L; Power (Watts): 0.1W, 1/10W; Temperature Coefficient: ±200ppm/°C; Supplier 1: Digi-Key; Supplier Part Number 1: YAG3372CT-ND; RoHS: RoHS Compliant; Category: Resistors; Stock 1: 155319; Pricing 1: 1=0.1, 10=0.022, 100=0.009, 1000=0.00402, 2500=0.00349 (USD); Packaging: Cut Tape (CT); Part Status: Active; Composition: Thick Film; Features: Moisture Resistant; Operating Temperature: -55°C ~ 155°C; Package / Case: 0603 (1608 Metric); Supplier Device Package: 0603; Size / Dimension: 0.063" L x 0.031" W (1.60mm x 0.80mm); Height - Seated (Max): 0.022" (0.55mm); Failure Rate: -; ComponentLink1URL: http://www.yageo.com/documents/recent/PYu-RC_Group_51_RoHS_L_7.pdf; ComponentLink1Description: http://www.yageo.com/documents/recent/PYu-RC_Group_51_RoHS_L_7.pdf
R16 = RES_18K_0603_1%: Resistor SMD chip 18K Ohm 0.1W 1% 0603; Manufacturer: Panasonic Electronic Components; Manufacturer Part Number: ERJ-3EKF1802V; Power (Watts): 0.1W, 1/10W; Temperature Coefficient: ±100ppm/°C; Supplier 1: Digi-Key; Supplier Part Number 1: P18.0KHCT-ND; RoHS: RoHS Compliant; Category: Resistors; Stock 1: 194634; Pricing 1: 1=0.1, 10=0.021, 100=0.0087, 1000=0.00389, 2500=0.00338 (USD); Packaging: Cut Tape (CT); Part Status: Active; Composition: Thick Film; Features: Automotive AEC-Q200; Operating Temperature: -55°C ~ 155°C; Package / Case: 0603 (1608 Metric); Supplier Device Package: 0603; Size / Dimension: 0.063" L x 0.031" W (1.60mm x 0.80mm); Height - Seated (Max): 0.022" (0.55mm); Failure Rate: -; ComponentLink1URL: https://industrial.panasonic.com/cdbs/www-data/pdf/RDA0000/AOA0000C304.pdf; ComponentLink1Description: https://industrial.panasonic.com/cdbs/www-data/pdf/RDA0000/AOA0000C304.pdf
R18 = RES_1.2M_0603_1%: Resistor SMD chip 1.2M Ohm 0.1W 1% 0603; Manufacturer: Panasonic Electronic Components; Manufacturer Part Number: ERJ-3EKF1204V; Power (Watts): 0.1W, 1/10W; Temperature Coefficient: ±100ppm/°C; Tolerance: ±1%; Supplier 1: Digi-Key; Supplier Part Number 1: P1.20MHCT-ND; RoHS: RoHS Compliant; Category: Resistors; Stock 1: 127237; Pricing 1: 1=0.1, 10=0.021, 100=0.0087, 1000=0.00389, 2500=0.00338 (USD); Packaging: Cut Tape (CT); Part Status: Active; Composition: Thick Film; Features: Automotive AEC-Q200; Operating Temperature: -55°C ~ 155°C; Package / Case: 0603 (1608 Metric); Supplier Device Package: 0603; Size / Dimension: 0.063" L x 0.031" W (1.60mm x 0.80mm); Height - Seated (Max): 0.022" (0.55mm); Failure Rate: -; ComponentLink1URL: https://industrial.panasonic.com/cdbs/www-data/pdf/RDA0000/AOA0000C304.pdf; ComponentLink1Description: https://industrial.panasonic.com/cdbs/www-data/pdf/RDA0000/AOA0000C304.pdf
R20 = RES_220K_0603_1%: Resistor SMD chip 220k Ohm 0.1W 1% 0603; Manufacturer: Panasonic Electronic Components; Manufacturer Part Number: ERJ-3EKF2203V; Power (Watts): 0.1W, 1/10W; Temperature Coefficient: ±100ppm/°C; Supplier 1: Digi-Key; Supplier Part Number 1: P220KHCT-ND; RoHS: RoHS Compliant; Category: Resistors; Stock 1: 479930; Pricing 1: 1=0.1, 10=0.021, 100=0.0087, 1000=0.00389, 2500=0.00338 (USD); Packaging: Cut Tape (CT); Part Status: Active; Tolerance: ±1%; Composition: Thick Film; Features: Automotive AEC-Q200; Operating Temperature: -55°C ~ 155°C; Package / Case: 0603 (1608 Metric); Supplier Device Package: 0603; Size / Dimension: 0.063" L x 0.031" W (1.60mm x 0.80mm); Height - Seated (Max): 0.022" (0.55mm); Failure Rate: -; ComponentLink1URL: https://industrial.panasonic.com/cdbs/www-data/pdf/RDA0000/AOA0000C304.pdf; ComponentLink1Description: https://industrial.panasonic.com/cdbs/www-data/pdf/RDA0000/AOA0000C304.pdf
R21 = RES_3K16_0603_1%: Resistor SMD chip 3.16k Ohm 0.1W 1% 0603; Manufacturer: Panasonic Electronic Components; Manufacturer Part Number: ERJ-3EKF3161V; Power (Watts): 0.1W, 1/10W; Temperature Coefficient: ±100ppm/°C; Tolerance: ±1%; Supplier 1: Digi-Key; Supplier Part Number 1: P3.16KHCT-ND; RoHS: RoHS Compliant; Category: Resistors; Stock 1: 228372; Pricing 1: 1=0.1, 10=0.021, 100=0.0087, 1000=0.00389, 2500=0.00338 (USD); Packaging: Cut Tape (CT); Part Status: Active; Composition: Thick Film; Features: Automotive AEC-Q200; Operating Temperature: -55°C ~ 155°C; Package / Case: 0603 (1608 Metric); Supplier Device Package: 0603; Size / Dimension: 0.063" L x 0.031" W (1.60mm x 0.80mm); Height - Seated (Max): 0.022" (0.55mm); Failure Rate: -; ComponentLink1URL: https://industrial.panasonic.com/cdbs/www-data/pdf/RDA0000/AOA0000C304.pdf; ComponentLink1Description: https://industrial.panasonic.com/cdbs/www-data/pdf/RDA0000/AOA0000C304.pdf
R24 = RES_180K_0603_1%: Resistor SMD chip 180K Ohm 0.1W 1% 0603; Manufacturer: Panasonic Electronic Components; Manufacturer Part Number: ERJ-3EKF1803V; Power (Watts): 0.1W, 1/10W; Temperature Coefficient: ±100ppm/°C; Tolerance: ±1%; Supplier 1: Digi-Key; Supplier Part Number 1: P180KHCT-ND; RoHS: RoHS Compliant; Category: Resistors; Stock 1: 8499; Pricing 1: 1=0.1, 10=0.021, 100=0.0087, 1000=0.00389, 2500=0.00338 (USD); Packaging: Cut Tape (CT); Part Status: Active; Composition: Thick Film; Features: Automotive AEC-Q200; Operating Temperature: -55°C ~ 155°C; Package / Case: 0603 (1608 Metric); Supplier Device Package: 0603; Size / Dimension: 0.063" L x 0.031" W (1.60mm x 0.80mm); Height - Seated (Max): 0.022" (0.55mm); Failure Rate: -; ComponentLink1URL: https://industrial.panasonic.com/cdbs/www-data/pdf/RDA0000/AOA0000C304.pdf; ComponentLink1Description: https://industrial.panasonic.com/cdbs/www-data/pdf/RDA0000/AOA0000C304.pdf
R25 = RES_44K2_0805_1%: Resistor SMD chip 44.2k Ohm 0.125W 1% 0805; Manufacturer: Panasonic Electronic Components; Manufacturer Part Number: ERJ-3EKF4422V; Power (Watts): 0.1W, 1/10W; Temperature Coefficient: ±100ppm/°C; Supplier 1: Digi-Key; Supplier Part Number 1: P44.2KHCT-ND; RoHS: RoHS Compliant; Category: Resistors; Stock 1: 148471; Pricing 1: 1=0.1, 10=0.021, 100=0.0087, 1000=0.00389, 2500=0.00338 (USD); Packaging: Cut Tape (CT); Part Status: Active; Composition: Thick Film; Features: Automotive AEC-Q200; Operating Temperature: -55°C ~ 155°C; Package / Case: 0603 (1608 Metric); Supplier Device Package: 0603; Size / Dimension: 0.063" L x 0.031" W (1.60mm x 0.80mm); Height - Seated (Max): 0.022" (0.55mm); Failure Rate: -; ComponentLink1URL: https://industrial.panasonic.com/cdbs/www-data/pdf/RDA0000/AOA0000C304.pdf; ComponentLink1Description: https://industrial.panasonic.com/cdbs/www-data/pdf/RDA0000/AOA0000C304.pdf
R26 = RES_11K3_0603_1%: Resistor SMD chip 11.3K Ohm 0.1W 1% 0603; Manufacturer: Panasonic Electronic Components; Manufacturer Part Number: ERJ-3EKF1132V; Power (Watts): 0.1W, 1/10W; Temperature Coefficient: ±100ppm/°C; Supplier 1: Digi-Key; Supplier Part Number 1: P11.3KHCT-ND; RoHS: RoHS Compliant; Category: Resistors; Stock 1: 3221; Pricing 1: 1=0.1, 10=0.021, 100=0.0087, 1000=0.00389, 2500=0.00338 (USD); Packaging: Cut Tape (CT); Part Status: Active; Composition: Thick Film; Features: Automotive AEC-Q200; Operating Temperature: -55°C ~ 155°C; Package / Case: 0603 (1608 Metric); Supplier Device Package: 0603; Size / Dimension: 0.063" L x 0.031" W (1.60mm x 0.80mm); Height - Seated (Max): 0.022" (0.55mm); Failure Rate: -; ComponentLink1URL: https://industrial.panasonic.com/cdbs/www-data/pdf/RDA0000/AOA0000C304.pdf; ComponentLink1Description: https://industrial.panasonic.com/cdbs/www-data/pdf/RDA0000/AOA0000C304.pdf
R27 = RES_TRIMMER_1K_25T_THT: Trimmer, 25-Turn, 1K cermet; Manufacturer 1: Murata Electronics North America; Manufacturer Part Number 1: PV36Y102C01B00; Tolerance: 10%; Ratings: 25 turn variable cermet; SCDType: spec; Supplier 1: Digi-Key; Supplier Part Number 1: 490-2912-ND
SNK1 = HEATSINK_OMNI-UNI-41-75: Heat Sink TO-247, TO-264 Aluminum Board Level, Vertical; Manufacturer: Wakefield-Vette; Attachment Method: Clip, Solder Foot; Shape: Rectangular, Fins; Material Finish: Black Anodized; Supplier 1: Digi-Key; Supplier Part Number 1: 345-1489-ND; RoHS: RoHS Compliant; Category: Fans, Thermal Management; Stock 1: 791; Pricing 1: 1=13.42, 10=12.671, 25=11.926, 50=11.1808, 100=10.4353, 250=9.68996, 500=9.5036, 1000=9.31725 (USD); Part Status: Active; Type: Board Level, Vertical; Package Cooled: TO-247, TO-264; Length: 2.953" (75.00mm); Width: 1.614" (41.00mm); Diameter: -; Height Off Base (Height of Fin): 2.480" (62.99mm); Power Dissipation @ Temperature Rise: -; Thermal Resistance @ Forced Air Flow: -; Thermal Resistance @ Natural: -; Material: Aluminum; ComponentLink1URL: http://www.wakefield-vette.com/Portals/0/omniKlip/omniKlip%20Wakefield%20Vette%20Data%20Sheet.pdf; ComponentLink1Description: http://www.wakefield-vette.com/Portals/0/omniKlip/omniKlip%20Wakefield%20Vette%20Data%20Sheet.pdf; Manufacturer Part Number: OMNI-UNI-41-75
SNK2 = HEATSINK_C247-025-1AE: Heat Sink TO-247 Aluminum 5W @ 60°C Board Level, Vertical; Manufacturer: Ohmite; Attachment Method: Clip and PC Pin; Shape: Rectangular, Fins; Thermal Resistance @ Forced Air Flow: 6°C/W @ 350 LFM; Material Finish: Black Anodized; Supplier 1: Digi-Key; Supplier Part Number 1: C247-025-1AE-ND; RoHS: RoHS Compliant; Category: Fans, Thermal Management; Stock 1: 359; Pricing 1: 1=4.01, 10=3.904, 25=3.798, 50=3.587, 100=3.376, 250=3.165, 500=3.0595, 1000=2.743 (USD); Part Status: Active; Type: Board Level, Vertical; Package Cooled: TO-247; Length: 0.984" (25.00mm); Width: 1.500" (38.10mm); Diameter: -; Height Off Base (Height of Fin): 0.710" (18.03mm); Power Dissipation @ Temperature Rise: 5W @ 60°C; Thermal Resistance @ Natural: -; Material: Aluminum; ComponentLink1URL: http://www.ohmite.com/assets/docs/sink_c.pdf?r=false; ComponentLink1Description: http://www.ohmite.com/assets/docs/sink_c.pdf?r=false; Manufacturer Part Number: C247-025-1AE
TP2-TP16 = TESTPOINT SMD 1206: Manufacturer: TE Connectivity AMP Connectors; Manufacturer Part Number: RCS-0C; Material - Insulation: No Insulation; Supplier 1: Digi-Key; Supplier Part Number 1: A106143CT-ND; RoHS: RoHS Compliant; Category: Test and Measurement; Stock 1: 28093; Pricing 1: 1=0.28, 10=0.261, 25=0.224, 50=0.1902, 100=0.1828, 250=0.16412, 500=0.15668, 1000=0.13056 (USD); Packaging: Cut Tape (CT); Part Status: Active; Type: PC Test Point; Mounting Type: Surface Mount; Color: Natural; Size / Dimension: 0.126" L x 0.063" W (3.20mm x 1.60mm); Height: 0.049" (1.25mm); Plating: -; Material - Body: -; ComponentLink1URL: http://www.te.com/commerce/DocumentDelivery/DDEController?Action=srchrtrv&DocNm=1773266&DocType=DS&DocLang=English; ComponentLink1Description: http://www.te.com/commerce/DocumentDelivery/DDEController?Action=srchrtrv&DocNm=1773266&DocType=DS&DocLang=English
TR1 = CURRENT_100:1_20A_CST1-100LB: Sufrace Mount Current Transformer 100:1 Ratio 20A; Frequency: 9kHz-1000kHz; Ratio: 100:1; Current (Max): 20A; Manufacturer Part Number: CST1-100LB
U1 = PFC_UC2855BDW: PFC IC Average Current 500kHz 20-SOIC; Manufacturer: Texas Instruments; Voltage - Supply: 10.5 V ~ 20 V; Supplier 1: Digi-Key; Supplier Part Number 1: 296-2498-5-ND; Packaging: Tube; Part Status: Active; Mode: Average Current; Frequency - Switching: 500kHz; Operating Temperature: -40°C ~ 85°C; Mounting Type: Surface Mount; Package / Case: 20-SOIC (0.295", 7.50mm Width); Supplier Device Package: 20-SOIC; ComponentLink1URL: http://www.ti.com/lit/ds/symlink/uc3855a.pdf; ComponentLink1Description: http://www.ti.com/lit/ds/symlink/uc3855a.pdf; RoHS: RoHS Compliant; Category: Integrated Circuits (ICs); Stock 1: 77; Pricing 1: 1=15.12, 10=13.896, 100=11.736, 500=10.44, 1000=9.576 (USD)
VR1 = Varistor_390V_4.5KA_B72214S0251K101: 390V Varistor Circuit Through Hole Disc 14mm; Manufacturer: EPCOS (TDK); Varistor Voltage (Min): 351V; Varistor Voltage (Max): 429V; Energy: 65J; Maximum AC Volts: 250VAC; Maximum DC Volts: 320VDC; Capacitance @ Frequency: 940pF @ 1kHz; Supplier 1: Digi-Key; Supplier Part Number 1: 495-4375-ND; RoHS: RoHS Compliant; Category: Circuit Protection; Stock 1: 4808; Pricing 1: 1=0.52, 10=0.438, 25=0.3836, 100=0.3288, 250=0.28496, 500=0.24112, 1000=0.18632, 2500=0.16988, 5000=0.15892 (USD); Packaging: Bulk; Part Status: Active; Operating Temperature: -40°C ~ 105°C (TA); Mounting Type: Through Hole; Package / Case: Disc 14mm; ComponentLink1URL: https://en.tdk.eu/inf/70/db/var_11/SIOV_Leaded_StandarD.pdf; ComponentLink1Description: https://en.tdk.eu/inf/70/db/var_11/SIOV_Leaded_StandarD.pdf; Manufacturer Part Number: B72214S0251K101